# Altium schematic sheet PCB_JTAG1D.SchDoc
size A4; Organization: Altium Limited; Address1: L3, 12a Rodborough Rd; Address2: Frenchs Forest; Address3: NSW; Address4: Australia 2086; DocumentNumber: 4; SheetNumber: 4; SheetTotal: 7
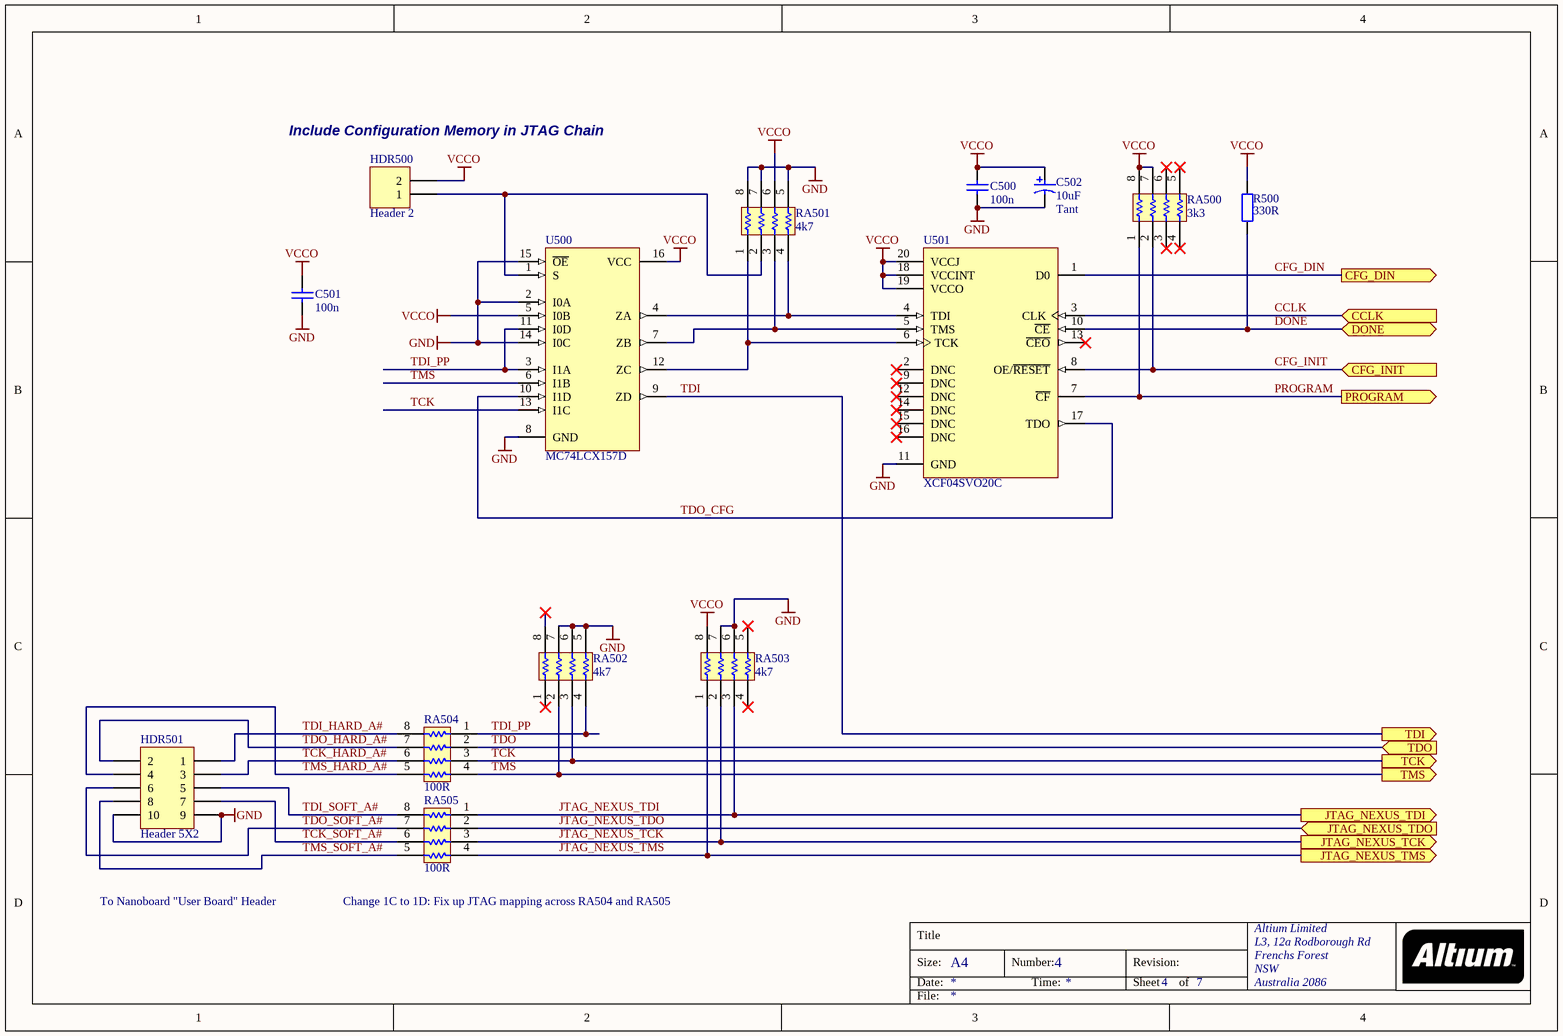
[diagram p0: PCB_JTAG1D.SchDoc]

## Parts
C500  100n  [CC2012-0805]
C501  100n  [CC2012-0805]
C502  10uF  Capacitor Type: Tant  [MCCT-B]
HDR500  Header 2  Usage: Include Configuration Memory in JTAG Chain  [HDR1X2]
HDR501  Header 5X2  Usage: To Nanoboard "User Board" Header  [HDR2X5]
R500  330R  [CC2012-0805]
RA500  3k3  [MNR34]
RA501  4k7  [MNR34]
RA502  4k7  [MNR34]
RA503  4k7  [MNR34]
RA504  100R  [MNR34]
RA505  100R  [MNR34]
U500  MC74LCX157D  [751B-05]
U501  XCF04SVO20C  [VO20]

## Ports
CCLK (in), CFG_DIN (out), CFG_INIT (in), DONE (bidir), JTAG_NEXUS_TCK (out), JTAG_NEXUS_TDI (out), JTAG_NEXUS_TDO (in), JTAG_NEXUS_TMS (out), PROGRAM (out), TCK (out), TDI (out), TDO (in), TMS (out)

## Nets
GND: C500.2 C501.2 C502.2 HDR501.9 HDR501.10 RA501.5 RA501.7 RA501.8 RA502.5 RA502.6 RA502.7 RA503.6 RA503.7 U500.2(I0A) U500.8(GND) U500.14(I0C) U500.15(~{OE}) U501.11(GND)
VCCO: C500.1 C501.1 C502.1 HDR500.2 R500.1 RA500.7 RA500.8 RA501.6 RA503.8 U500.5(I0B) U500.16(VCC) U501.18(VCCINT) U501.19(VCCO) U501.20(VCCJ)
CCLK: U501.3(CLK) ; port CCLK
CFG_DIN: U501.1(D0) ; port CFG_DIN
CFG_INIT: RA500.2 U501.8(OE/~{RESET}) ; port CFG_INIT
DONE: R500.2 U501.10(~{CE}) ; port DONE
JTAG_NEXUS_TCK: RA503.2 RA505.3 ; port JTAG_NEXUS_TCK
JTAG_NEXUS_TDI: RA503.3 RA505.1 ; port JTAG_NEXUS_TDI
JTAG_NEXUS_TDO: RA505.2 ; port JTAG_NEXUS_TDO
JTAG_NEXUS_TMS: RA503.1 RA505.4 ; port JTAG_NEXUS_TMS
PROGRAM: RA500.1 U501.7(~{CF}) ; port PROGRAM
TCK: RA502.3 RA504.3 U500.13(I1C) ; port TCK
TCK_HARD_A#: HDR501.3 RA504.6
TCK_SOFT_A#: HDR501.7 RA505.6
TDI: U500.9(ZD) ; port TDI
TDI_HARD_A#: HDR501.1 RA504.8
TDI_PP: RA502.4 RA504.1 U500.3(I1A) U500.11(I0D)
TDI_SOFT_A#: HDR501.5 RA505.8
TDO: RA504.2 ; port TDO
TDO_CFG: U500.10(I1D) U501.17(TDO)
TDO_HARD_A#: HDR501.2 RA504.7
TDO_SOFT_A#: HDR501.6 RA505.7
TMS: RA502.2 RA504.4 U500.6(I1B) ; port TMS
TMS_HARD_A#: HDR501.4 RA504.5
TMS_SOFT_A#: HDR501.8 RA505.5
NetHDR500_1: HDR500.1 RA501.2 U500.1(S)
NetRA501_1: RA501.1 U500.12(ZC) U501.6(TCK)
NetRA501_3: RA501.3 U500.7(ZB) U501.5(TMS)
NetRA501_4: RA501.4 U500.4(ZA) U501.4(TDI)

Not connected (* = marked no-connect by the designer): RA500 3* 4* 5* 6*; RA502 1* 8*; RA503 4* 5*; U501 2(DNC)* 9(DNC)* 12(DNC)* 13(~{CEO})* 14(DNC)* 15(DNC)* 16(DNC)*

## Notes on the sheet
- (near RA505) Change 1C to 1D: Fix up JTAG mapping across RA504 and RA505
- Title
- Size:
- Date:
- A4
- Number:
- Time:
- Revision:
- Sheet
- of
- File:

## Library data of the parts
C500 C501 = CAP: Capacitor; Fitted: True
C502 = CAP_POLAR: Polar Capacitor; Fitted: True
HDR500 = Header 2: Header, 2-Pin; Manufacturer: Generic Components; Class I: Connector; Fitted: False; Revision: July-2002: Re-released for DXP Platform.; Publisher: Altium Limited
HDR501 = Header 5X2: Header, 5-Pin, Dual row; Manufacturer: Generic Components; Class I: Connector; Fitted: True; Revision: July-2002: Re-released for DXP Platform.; Publisher: Altium Limited
R500 = Res2: Resistor; Manufacturer: Generic Components; Class I: Passive; Published: 8-Jun-2000; Revision: July-2002: Re-released for DXP Platform.; Publisher: Altium Limited; Class II: Resistor
RA500-RA505 = MNR34: 3216x4 Resistor Array; Fitted: True
U500 = MC74LCX157D: Low-Voltage Quad 2-Input Multiplexer with 5V-Tolerant Inputs (Non-Inverting); Manufacturer: ON Semiconductor; Package Information: Latest Revision: Oct-1999; Code - JEDEC: MS-012-AC; Code - IPC: SO16; Published: 15-Apr-2002; Datasheet: Latest Revision: 1997; Package Reference: 751B-05; Publisher: Altium Limited
U501 = XCF04SVO20C: XCF00S Series, Platform Flash In-System Programmable Configuration 3.3V PROM, 20-Pin TSOP, 4-Megabit, Commercial Grade; Manufacturer: Xilinx; Package Information: Latest Revision: ver1.0, May-2003; Code - JEDEC: MO-153-AC; Published: 17-Sep-2003; Datasheet: Latest Revision: ver1.1, Jun-2003; Package Reference: VO20; Publisher: Altium Limited